# Altium schematic sheet PSU.SchDoc
size A3; SheetNumber: 12; SheetTotal: 13
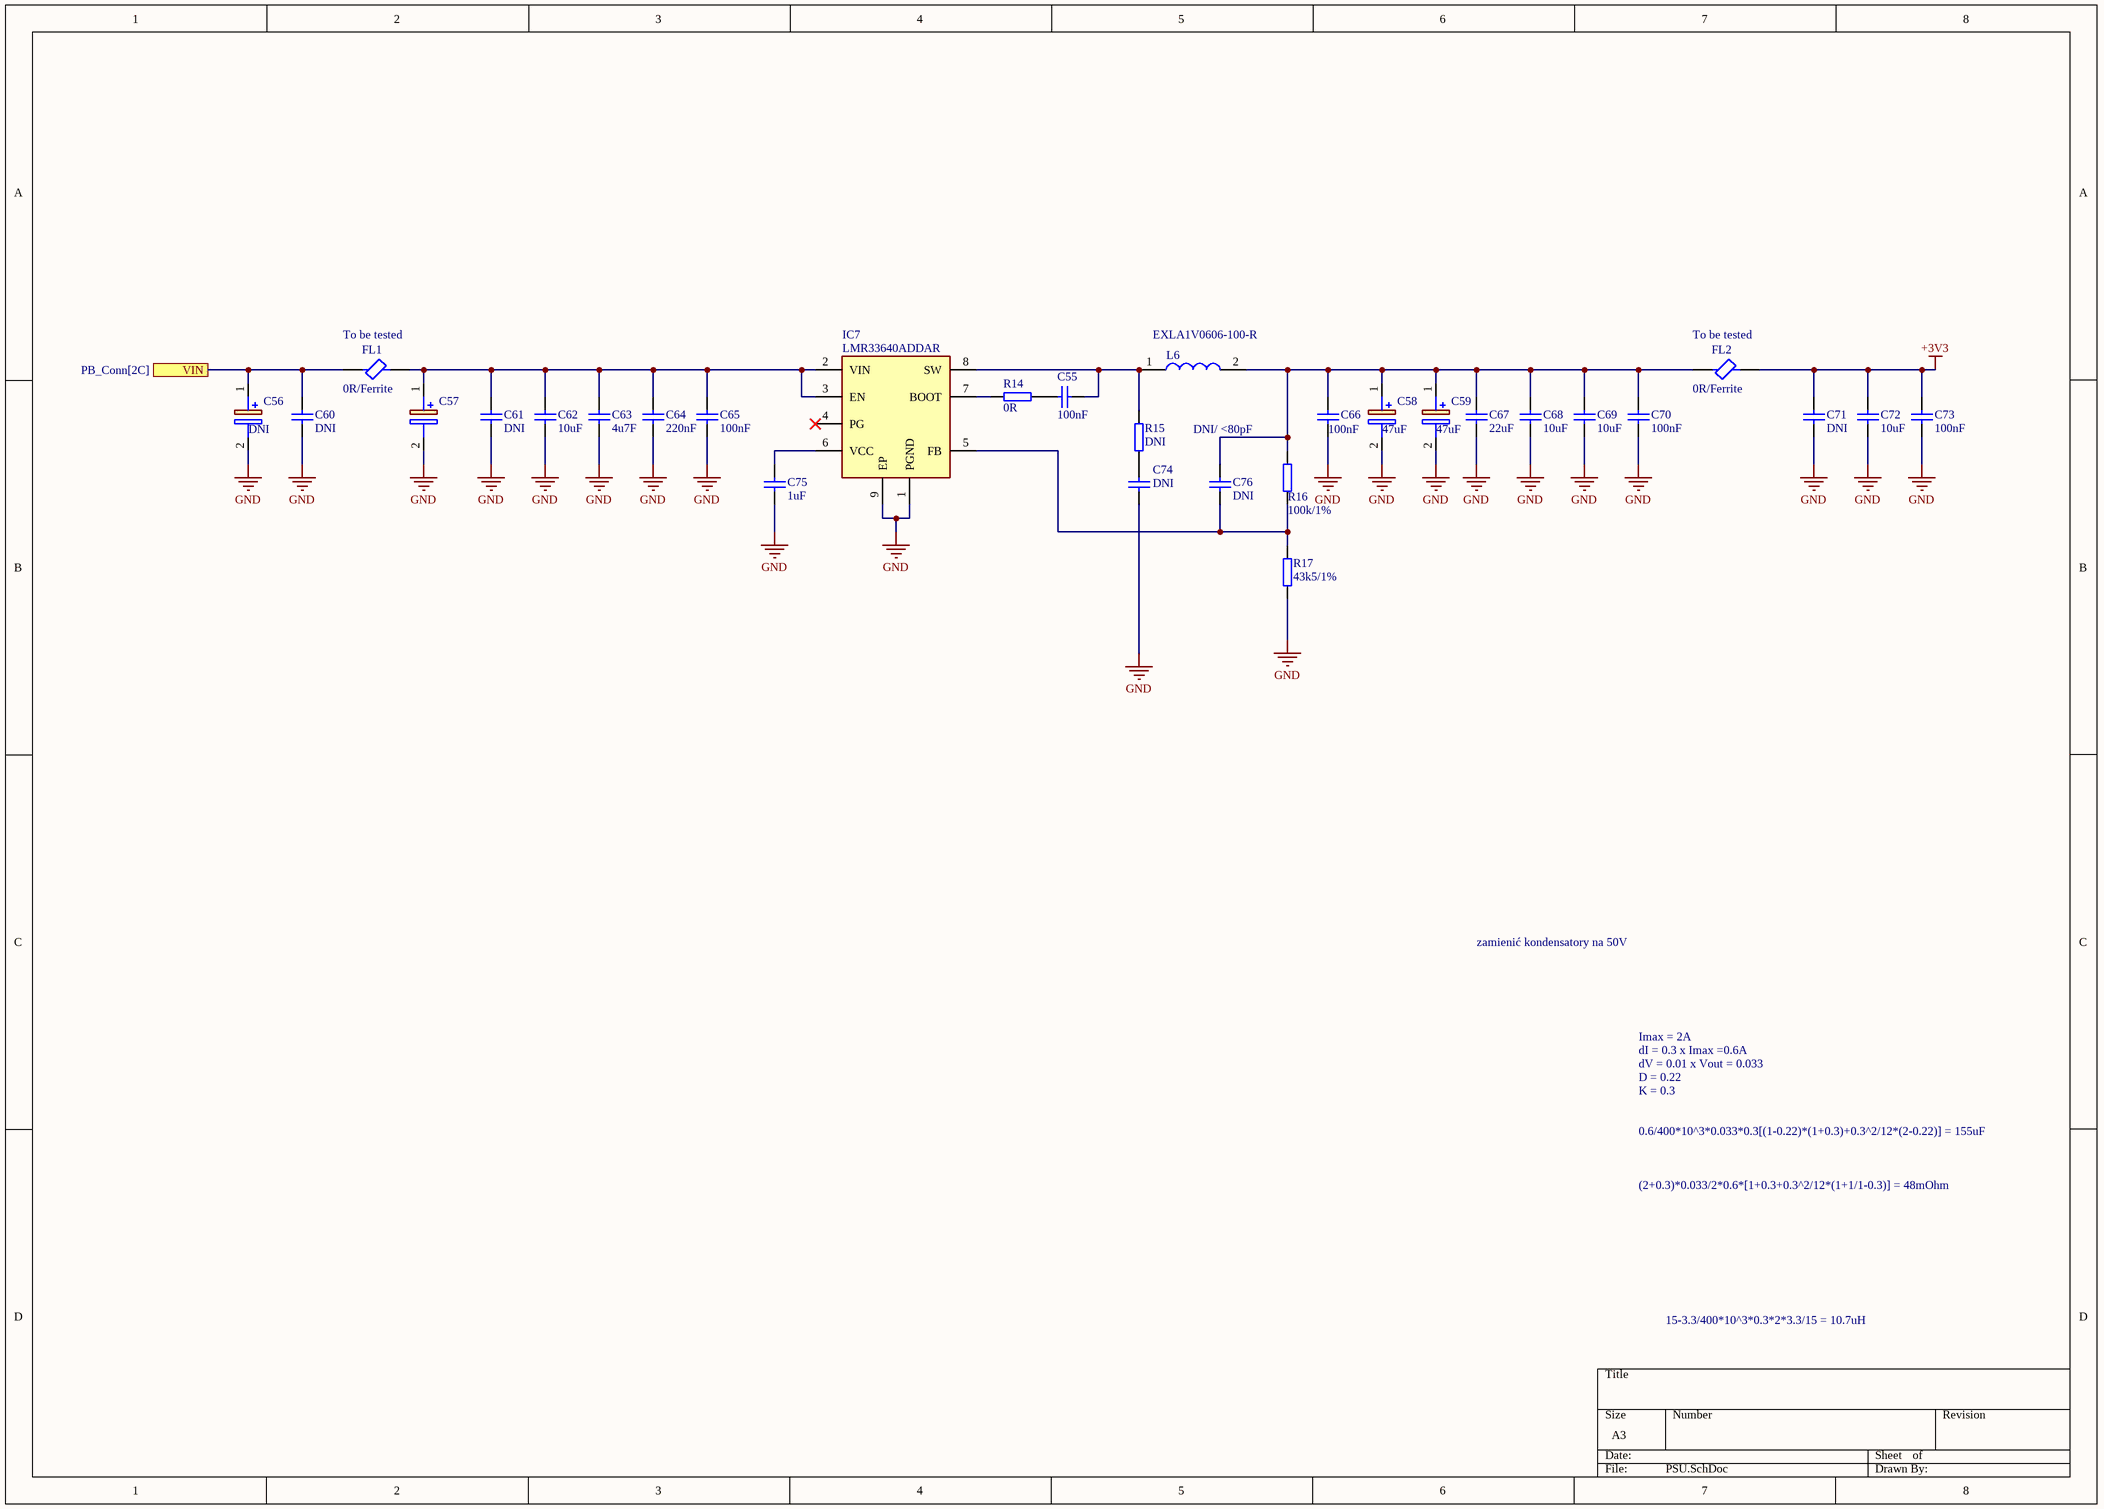
[diagram p0: PSU.SchDoc]

## Parts
C55  value 100nF  [CAP0402]  (hidden comment: Cap0402)
C56  value DNI  [CAPPM7343X310N]  (hidden comment: TR3D336K025D0200)
C57  TR3D336K025D0200  [CAPPM7343X310N]  (value not drawn)
C58  value 47uF  [CAPPC2012X90N]  (hidden comment: T58W9476M6R3C0200)
C59  value 47uF  [CAPPC2012X90N]  (hidden comment: T58W9476M6R3C0200)
C60  value DNI  [CAP0805]  (hidden comment: Cap0805)
C61  value DNI  [CAP0805]  (hidden comment: Cap0805)
C62  value 10uF  [CAP0805]  (hidden comment: Cap0805)
C63  value 4u7F  [CAP0805]  (hidden comment: Cap0805)
C64  value 220nF  [CAP0402]  (hidden comment: Cap0402)
C65  value 100nF  [CAP0402]  (hidden comment: Cap0402)
C66  value 100nF  [CAP0402]  (hidden comment: Cap0402)
C67  value 22uF  [CAP0805]  (hidden comment: Cap0805)
C68  value 10uF  [CAP0603]  (hidden comment: Cap0603)
C69  value 10uF  [CAP0603]  (hidden comment: Cap0603)
C70  value 100nF  [CAP0402]  (hidden comment: Cap0402)
C71  value DNI  [CAP0805]  (hidden comment: Cap0805)
C72  value 10uF  [CAP0603]  (hidden comment: Cap0603)
C73  value 100nF  [CAP0402]  (hidden comment: Cap0402)
C74  value DNI  [CAP0402]  (hidden comment: Cap0402)
C75  value 1uF  [CAP0402]  (hidden comment: Cap0402)
C76  value DNI  [CAP0402]  (hidden comment: Cap0402)
FL1  0R/Ferrite  [BLM31KN102BH1L]
FL2  0R/Ferrite  [BLM31KN102BH1L]
IC7  LMR33640ADDAR  [SOIC127P600X170-9N]
L6  EXLA1V0606-100-R  [EXLA1V0606100R]
R14  value 0R  [RES0402]  (hidden comment: Res0402)
R15  value DNI  [RES0402]  (hidden comment: Res0402)
R16  value 100k/1%  [RES0402]  (hidden comment: Res0402)
R17  value 43k5/1%  [RES0402]  (hidden comment: Res0402)

## Ports
VIN (see PB_Conn[2C])

## Nets
+3V3: C71.2 C72.2 C73.2 FL2.2
GND: C56.2(-) C57.2(-) C58.2(-) C59.2(-) C60.1 C61.1 C62.1 C63.1 C64.1 C65.1 C66.1 C67.1 C68.1 C69.1 C70.1 C71.1 C72.1 C73.1 C74.2 C75.1 IC7.1(PGND) IC7.9(EP) R17.1
VIN: C56.1(+) C60.2 FL1.1 ; port VIN
NetC55_1: C55.1 R14.2
NetC55_2: C55.2 IC7.8(SW) L6.1 R15.1
NetC57_1: C57.1(+) C61.2 C62.2 C63.2 C64.2 C65.2 FL1.2 IC7.2(VIN) IC7.3(EN)
NetC58_1: C58.1(+) C59.1(+) C66.2 C67.2 C68.2 C69.2 C70.2 C76.2 FL2.1 L6.2 R16.2
NetC74_1: C74.1 R15.2
NetC75_2: C75.2 IC7.6(VCC)
NetC76_1: C76.1 IC7.5(FB) R16.1 R17.2
NetIC7_7: IC7.7(BOOT) R14.1

Not connected (* = marked no-connect by the designer): IC7 4(PG)*

## Notes on the sheet
- (near FL1) To be tested
- (near FL2) To be tested
- DNI/ <80pF
- zamienić kondensatory na 50V
- dI = 0.3 x Imax =0.6A
- Imax = 2A
- dV = 0.01 x Vout = 0.033
- K = 0.3
- D = 0.22
- 0.6/400*10^3*0.033*0.3[(1-0.22)*(1+0.3)+0.3^2/12*(2-0.22)] = 155uF
- (2+0.3)*0.033/2*0.6*[1+0.3+0.3^2/12*(1+1/1-0.3)] = 48mOhm
- 15-3.3/400*10^3*0.3*2*3.3/15 = 10.7uH

## Library data of the parts
C55 C66 C70 C73 = Cap0402: Manufacturer_Part_Number: GRM155R71H104ME14D; Voltage: 25V
C56 = TR3D336K025D0200: Capacitor Polarised; Voltage: DNI
C57 = TR3D336K025D0200: Capacitor Polarised; Manufacturer_Name: Vishay; Value: 33uF; Datasheet Link: http://www.vishay.com/doc?40080; Height: 3.1mm; Manufacturer_Part_Number: TR3D336K025D0200; Mouser Part Number: 74-TR3D336K025D0200; Mouser Price/Stock: https://www.mouser.com/Search/Refine.aspx?Keyword=74-TR3D336K025D0200
C58 C59 = T58W9476M6R3C0200: Capacitor Polarised; Voltage: 6V3; Manufacturer_Part_Number: T58W9476M6R3C0200
C60 C61 = Cap0805: Voltage: 35V
C62 = Cap0805: Manufacturer_Part_Number: GRM21BR61H106KE43K; Voltage: 35V
C63 = Cap0805: Manufacturer_Part_Number: GRM21BR61H475ME51L; Voltage: 35V
C64 = Cap0402: Manufacturer_Part_Number: GRM155R61H224ME01W; Voltage: 35V
C65 = Cap0402: Manufacturer_Part_Number: GRM155R71H104ME14D; Voltage: 35V
C67 = Cap0805: Manufacturer_Part_Number: CL21A226MAYNNNE; Voltage: 25V
C68 C69 C72 = Cap0603: Manufacturer_Part_Number: GRM188R61E106MA73J; Voltage: 25V
C75 = Cap0402: Manufacturer_Part_Number: GRM155R61H105KE05J; Voltage: 35V
FL1 FL2 = BLM31KN121SH1L: Filter
IC7 = LMR33640ADDAR: Integrated Circuit; Manufacturer_Name: Texas Instruments; Datasheet Link: https://www.ti.com/lit/gpn/LMR33640; Height: 1.7mm; Manufacturer_Part_Number: LMR33640ADDAR; Arrow Part Number: LMR33640ADDAR; Arrow Price/Stock: https://www.arrow.com/en/products/lmr33640addar/texas-instruments
L6 = EXLA1V0606-100-R: Inductor; Manufacturer_Name: Eaton; Datasheet Link: https://www.eaton.com/content/dam/eaton/products/electronic-components/resources/data-sheet/eaton-exla1v06-automotive-high-current-molded-inductor-data-sheet-elx1221-en.pdf; Height: 6mm; Manufacturer_Part_Number: EXLA1V0606-100-R; Mouser Part Number: 704-EXLA1V0606-100-R; Mouser Price/Stock: https://www.mouser.co.uk/ProductDetail/Bussmann-Eaton/EXLA1V0606-100-R?qs=T%252BzbugeAwjhRVU8Dylvhsg%3D%3D
R14 = Res0402: Manufacturer_Part_Number: RCA04020000ZSED
R16 = Res0402: Manufacturer_Part_Number: RC0402JR-13100KL
R17 = Res0402: Manufacturer_Part_Number: ERA-2AEB4322X
C71 = Cap0805: Voltage: DNI
C74 C76 = Cap0402: Voltage: DNI